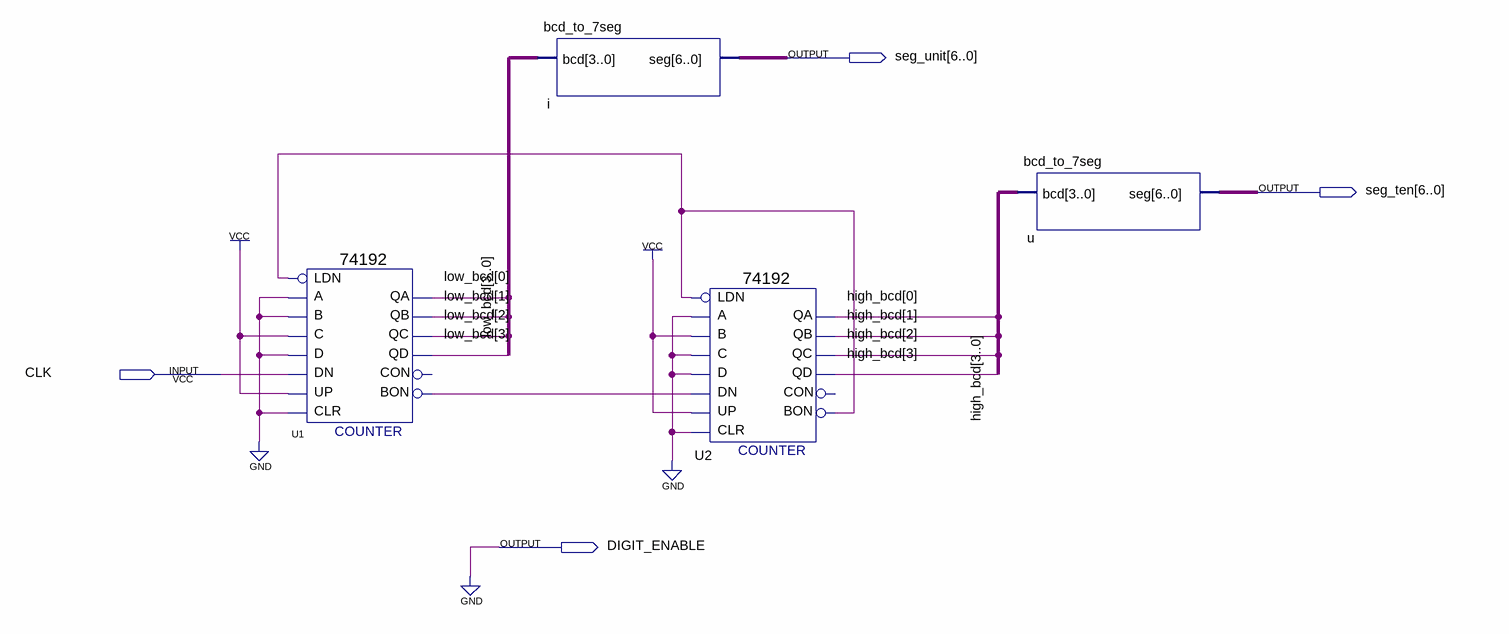
[diagram p0: schematic sheet]
// Quartus schematic cnt25.bdf as structural Verilog: 4 symbols, 4 pins
module cnt25 (
  input  CLK,
  output [6:0] seg_unit,
  output [6:0] seg_ten,
  output DIGIT_ENABLE
);

  wire U1_bon, U2_bon;
  wire [3:0] high_bcd, low_bcd;

  \74192  U1 (
    .D(1'b0), .C(1'b1), .A(1'b0), .B(1'b0), .CLR(1'b0), .UP(1'b1), .DN(CLK), .LDN(U2_bon), .QB(low_bcd[1]),
    .BON(U1_bon), .QA(low_bcd[0]), .QC(low_bcd[2]), .QD(low_bcd[3]));  // open: CON
  bcd_to_7seg i (.bcd(low_bcd), .seg(seg_unit));
  \74192  U2 (
    .D(1'b0), .C(1'b0), .A(1'b0), .B(1'b1), .CLR(1'b0), .UP(1'b1), .DN(U1_bon), .LDN(U2_bon),
    .QB(high_bcd[1]), .BON(U2_bon), .QA(high_bcd[0]), .QC(high_bcd[2]), .QD(high_bcd[3]));  // open: CON
  bcd_to_7seg u (.bcd(high_bcd), .seg(seg_ten));

  assign DIGIT_ENABLE = 1'b0;
endmodule
